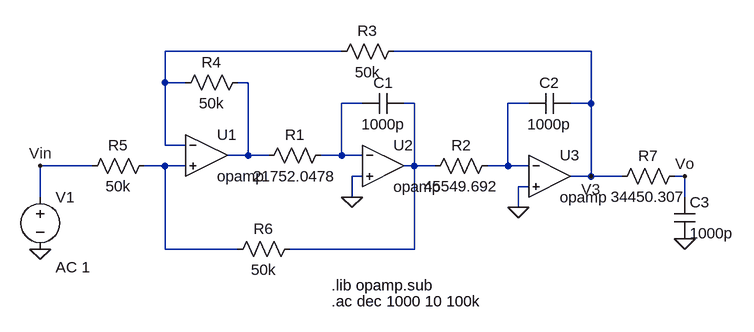
[diagram p0: schematic circuito simulación desnormalizado.asc]
circuito simulación desnormalizado.asc, the LTspice schematic file:
Version 4
SHEET 1 880 680
WIRE 240 -48 -32 -48
WIRE 624 -48 320 -48
WIRE -32 0 -32 -48
WIRE 0 0 -32 0
WIRE 96 0 80 0
WIRE 272 32 240 32
WIRE 352 32 336 32
WIRE 528 32 496 32
WIRE 624 32 624 -48
WIRE 624 32 592 32
WIRE -32 96 -32 0
WIRE 0 96 -32 96
WIRE 96 112 96 0
WIRE 96 112 64 112
WIRE 128 112 96 112
WIRE 240 112 240 32
WIRE 240 112 208 112
WIRE 272 112 240 112
WIRE -144 128 -224 128
WIRE -32 128 -64 128
WIRE 0 128 -32 128
WIRE 352 128 352 32
WIRE 352 128 336 128
WIRE 384 128 352 128
WIRE 496 128 496 32
WIRE 496 128 464 128
WIRE 528 128 496 128
WIRE 272 144 256 144
WIRE 624 144 624 32
WIRE 624 144 592 144
WIRE 672 144 624 144
WIRE 768 144 752 144
WIRE 528 160 512 160
WIRE -224 176 -224 128
WIRE 256 176 256 144
WIRE 768 176 768 144
WIRE 512 192 512 160
WIRE -32 256 -32 128
WIRE 80 256 -32 256
WIRE 352 256 352 128
WIRE 352 256 160 256
FLAG 256 176 0
FLAG 512 192 0
FLAG -224 128 Vin
FLAG 624 144 V3
FLAG -224 256 0
FLAG 768 240 0
FLAG 768 144 Vo
SYMBOL OpAmps\\opamp 304 64 R0
SYMATTR InstName U2
SYMBOL OpAmps\\opamp 560 80 R0
SYMATTR InstName U3
SYMBOL res 224 96 R90
WINDOW 0 0 56 VBottom 2
WINDOW 3 32 56 VTop 2
SYMATTR InstName R1
SYMATTR Value 21752.0478
SYMBOL res 480 112 R90
WINDOW 0 0 56 VBottom 2
WINDOW 3 32 56 VTop 2
SYMATTR InstName R2
SYMATTR Value 45549.692
SYMBOL res 336 -64 R90
WINDOW 0 0 56 VBottom 2
WINDOW 3 32 56 VTop 2
SYMATTR InstName R3
SYMATTR Value 50k
SYMBOL res 96 -16 R90
WINDOW 0 0 56 VBottom 2
WINDOW 3 32 56 VTop 2
SYMATTR InstName R4
SYMATTR Value 50k
SYMBOL res -48 112 R90
WINDOW 0 0 56 VBottom 2
WINDOW 3 32 56 VTop 2
SYMATTR InstName R5
SYMATTR Value 50k
SYMBOL res 176 240 R90
WINDOW 0 0 56 VBottom 2
WINDOW 3 32 56 VTop 2
SYMATTR InstName R6
SYMATTR Value 50k
SYMBOL cap 336 16 R90
WINDOW 0 0 32 VBottom 2
WINDOW 3 32 32 VTop 2
SYMATTR InstName C1
SYMATTR Value 1000p
SYMBOL cap 592 16 R90
WINDOW 0 0 32 VBottom 2
WINDOW 3 32 32 VTop 2
SYMATTR InstName C2
SYMATTR Value 1000p
SYMBOL voltage -224 160 R0
WINDOW 123 24 124 Left 2
WINDOW 39 0 0 Left 0
SYMATTR Value2 AC 1
SYMATTR InstName V1
SYMATTR Value ""
SYMBOL OpAmps\\opamp 32 48 R0
SYMATTR InstName U1
SYMBOL cap 752 176 R0
SYMATTR InstName C3
SYMATTR Value 1000p
SYMBOL res 768 128 R90
WINDOW 0 0 56 VBottom 2
WINDOW 3 32 56 VTop 2
SYMATTR InstName R7
SYMATTR Value 34450.307
TEXT 224 312 Left 2 !.lib opamp.sub
TEXT 224 336 Left 2 !.ac dec 1000 10 100k

The netlist it stands for:
* circuito simulación desnormalizado.asc
XU2 N003 0 N004 opamp Aol=100K GBW=10Meg  ; pins invin noninvin out
XU3 N005 0 V3 opamp Aol=100K GBW=10Meg  ; pins invin noninvin out
R1 N003 N002 21752.0478
R2 N005 N004 45549.692
R3 V3 N001 50k
R4 N002 N001 50k
R5 N006 Vin 50k
R6 N004 N006 50k
C1 N004 N003 1000p
C2 V3 N005 1000p
V1 Vin 0 AC 1
XU1 N001 N006 N002 opamp Aol=100K GBW=10Meg  ; pins invin noninvin out
C3 Vo 0 1000p
R7 Vo V3 34450.307
.lib opamp.sub
.ac dec 1000 10 100k
.backanno
.end